# EAGLE schematic board (EAGLE 6.4)
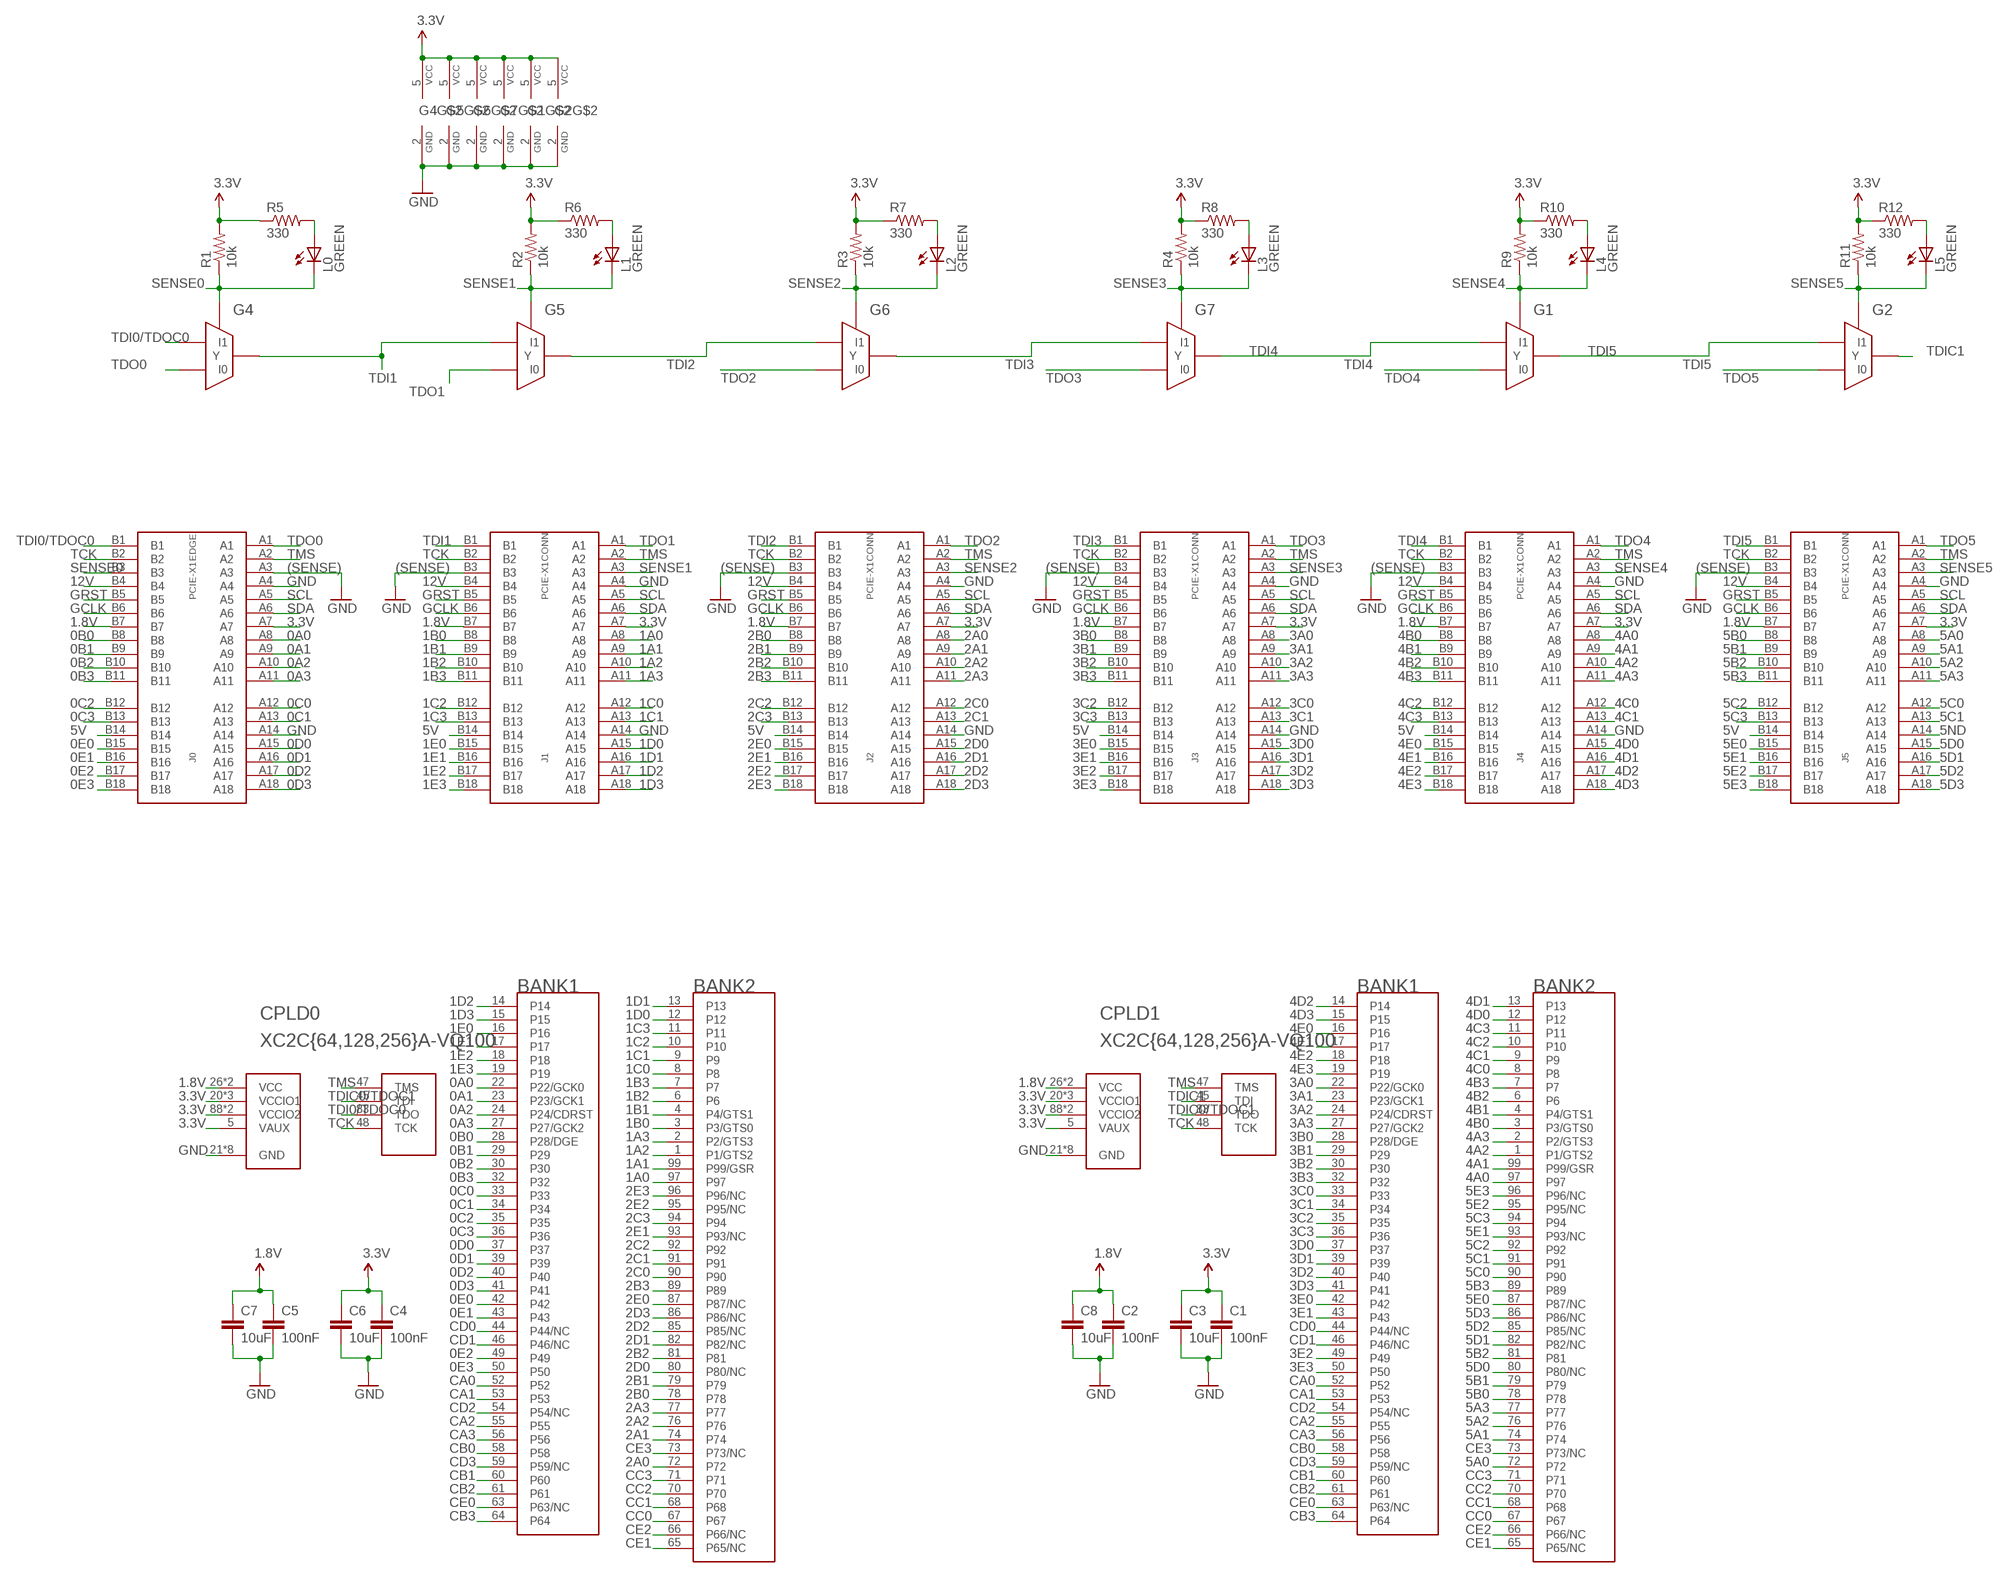
[diagram p0: schematic, sheet 1]

## Parts
C1  100nF  CAP0402-CAP  [0402-CAP]
C2  100nF  CAP0402-CAP  [0402-CAP]
C3  10uF  CAP0805  [0805]
C4  100nF  CAP0402-CAP  [0402-CAP]
C5  100nF  CAP0402-CAP  [0402-CAP]
C6  10uF  CAP0805  [0805]
C7  10uF  CAP0805  [0805]
C8  10uF  CAP0805  [0805]
CPLD0  XC2C{64,128,256}A-VQ100  [XILINX_TQ100]
CPLD1  XC2C{64,128,256}A-VQ100  [XILINX_TQ100]
G1  74G157  [SOT363]
G2  74G157  [SOT363]
G4  74G157  [SOT363]
G5  74G157  [SOT363]
G6  74G157  [SOT363]
G7  74G157  [SOT363]
J0  PCIE-X1EDGE  [PCIE-X1-EDGE]
J1  PCIE-X1CONN  [PCIE-X1-CONN]
J2  PCIE-X1CONN  [PCIE-X1-CONN]
J3  PCIE-X1CONN  [PCIE-X1-CONN]
J4  PCIE-X1CONN  [PCIE-X1-CONN]
J5  PCIE-X1CONN  [PCIE-X1-CONN]
L0  GREEN  LED0603  [0603_LED]
L1  GREEN  LED0603  [0603_LED]
L2  GREEN  LED0603  [0603_LED]
L3  GREEN  LED0603  [0603_LED]
L4  GREEN  LED0603  [0603_LED]
L5  GREEN  LED0603  [0603_LED]
R1  10k  RESISTOR0603  [0603-RES]
R2  10k  RESISTOR0603  [0603-RES]
R3  10k  RESISTOR0603  [0603-RES]
R4  10k  RESISTOR0603  [0603-RES]
R5  330  RESISTOR0603  [0603-RES]
R6  330  RESISTOR0603  [0603-RES]
R7  330  RESISTOR0603  [0603-RES]
R8  330  RESISTOR0603  [0603-RES]
R9  10k  RESISTOR0603  [0603-RES]
R10  330  RESISTOR0603  [0603-RES]
R11  10k  RESISTOR0603  [0603-RES]
R12  330  RESISTOR0603  [0603-RES]

## Nets
0A0: CPLD0.22(P22/GCK0) J0.A8
0A1: CPLD0.23(P23/GCK1) J0.A9
0A2: CPLD0.24(P24/CDRST) J0.A10
0A3: CPLD0.27(P27/GCK2) J0.A11
0B0: CPLD0.28(P28/DGE) J0.B8
0B1: CPLD0.29 J0.B9
0B2: CPLD0.30 J0.B10
0B3: CPLD0.32 J0.B11
0C0: CPLD0.33 J0.A12
0C1: CPLD0.34 J0.A13
0C2: CPLD0.35 J0.B12
0C3: CPLD0.36 J0.B13
0D0: CPLD0.37 J0.A15
0D1: CPLD0.39 J0.A16
0D2: CPLD0.40 J0.A17
0D3: CPLD0.41 J0.A18
0E0: CPLD0.42 J0.B15
0E1: CPLD0.43 J0.B16
0E2: CPLD0.49 J0.B17
0E3: CPLD0.50 J0.B18
1.8V [pwr]: C2.1 C5.1 C7.1 C8.1 CPLD0.26(VCC) CPLD0.57(VCC) CPLD1.26(VCC) CPLD1.57(VCC) J0.B7 J1.B7 J2.B7 J3.B7 J4.B7 J5.B7
1A0: CPLD0.97 J1.A8
1A1: CPLD0.99(P99/GSR) J1.A9
1A2: CPLD0.1(P1/GTS2) J1.A10
1A3: CPLD0.2(P2/GTS3) J1.A11
1B0: CPLD0.3(P3/GTS0) J1.B8
1B1: CPLD0.4(P4/GTS1) J1.B9
1B2: CPLD0.6 J1.B10
1B3: CPLD0.7 J1.B11
1C0: CPLD0.8 J1.A12
1C1: CPLD0.9 J1.A13
1C2: CPLD0.10 J1.B12
1C3: CPLD0.11 J1.B13
1D0: CPLD0.12 J1.A15
1D1: CPLD0.13 J1.A16
1D2: CPLD0.14 J1.A17
1D3: CPLD0.15 J1.A18
1E0: CPLD0.16 J1.B15
1E1: CPLD0.17 J1.B16
1E2: CPLD0.18 J1.B17
1E3: CPLD0.19 J1.B18
2A0: CPLD0.72 J2.A8
2A1: CPLD0.74 J2.A9
2A2: CPLD0.76 J2.A10
2A3: CPLD0.77 J2.A11
2B0: CPLD0.78 J2.B8
2B1: CPLD0.79 J2.B9
2B2: CPLD0.81 J2.B10
2B3: CPLD0.89 J2.B11
2C0: CPLD0.90 J2.A12
2C1: CPLD0.91 J2.A13
2C2: CPLD0.92 J2.B12
2C3: CPLD0.94 J2.B13
2D0: CPLD0.80(P80/NC) J2.A15
2D1: CPLD0.82(P82/NC) J2.A16
2D2: CPLD0.85(P85/NC) J2.A17
2D3: CPLD0.86(P86/NC) J2.A18
2E0: CPLD0.87(P87/NC) J2.B15
2E1: CPLD0.93(P93/NC) J2.B16
2E2: CPLD0.95(P95/NC) J2.B17
2E3: CPLD0.96(P96/NC) J2.B18
3.3V [pwr]: C1.1 C3.1 C4.1 C6.1 CPLD0.5(VAUX) CPLD0.20(VCCIO1) CPLD0.38(VCCIO1) CPLD0.51(VCCIO1) CPLD0.88(VCCIO2) CPLD0.98(VCCIO2) CPLD1.5(VAUX) CPLD1.20(VCCIO1) CPLD1.38(VCCIO1) CPLD1.51(VCCIO1) CPLD1.88(VCCIO2) CPLD1.98(VCCIO2) G1.5(VCC) G2.5(VCC) G4.5(VCC) G5.5(VCC) G6.5(VCC) G7.5(VCC) J0.A7 J1.A7 J2.A7 J3.A7 J4.A7 J5.A7 R1.2 R2.2 R3.2 R4.2 R5.1 R6.1 R7.1 R8.1 R9.2 R10.1 R11.2 R12.1
3A0: CPLD1.22(P22/GCK0) J3.A8
3A1: CPLD1.23(P23/GCK1) J3.A9
3A2: CPLD1.24(P24/CDRST) J3.A10
3A3: CPLD1.27(P27/GCK2) J3.A11
3B0: CPLD1.28(P28/DGE) J3.B8
3B1: CPLD1.29 J3.B9
3B2: CPLD1.30 J3.B10
3B3: CPLD1.32 J3.B11
3C0: CPLD1.33 J3.A12
3C1: CPLD1.34 J3.A13
3C2: CPLD1.35 J3.B12
3C3: CPLD1.36 J3.B13
3D0: CPLD1.37 J3.A15
3D1: CPLD1.39 J3.A16
3D2: CPLD1.40 J3.A17
3D3: CPLD1.41 J3.A18
3E0: CPLD1.42 J3.B15
3E1: CPLD1.43 J3.B16
3E2: CPLD1.49 J3.B17
3E3: CPLD1.50 J3.B18
4A0: CPLD1.97 J4.A8
4A1: CPLD1.99(P99/GSR) J4.A9
4A2: CPLD1.1(P1/GTS2) J4.A10
4A3: CPLD1.2(P2/GTS3) J4.A11
4B0: CPLD1.3(P3/GTS0) J4.B8
4B1: CPLD1.4(P4/GTS1) J4.B9
4B2: CPLD1.6 J4.B10
4B3: CPLD1.7 J4.B11
4C0: CPLD1.8 J4.A12
4C1: CPLD1.9 J4.A13
4C2: CPLD1.10 J4.B12
4C3: CPLD1.11 J4.B13
4D0: CPLD1.12 J4.A15
4D1: CPLD1.13 J4.A16
4D2: CPLD1.14 J4.A17
4D3: CPLD1.15 J4.A18
4E0: CPLD1.16 J4.B15
4E1: CPLD1.17 J4.B16
4E2: CPLD1.18 J4.B17
4E3: CPLD1.19 J4.B18
5A0: CPLD1.72 J5.A8
5A1: CPLD1.74 J5.A9
5A2: CPLD1.76 J5.A10
5A3: CPLD1.77 J5.A11
5B0: CPLD1.78 J5.B8
5B1: CPLD1.79 J5.B9
5B2: CPLD1.81 J5.B10
5B3: CPLD1.89 J5.B11
5C0: CPLD1.90 J5.A12
5C1: CPLD1.91 J5.A13
5C2: CPLD1.92 J5.B12
5C3: CPLD1.94 J5.B13
5D0: CPLD1.80(P80/NC) J5.A15
5D1: CPLD1.82(P82/NC) J5.A16
5D2: CPLD1.85(P85/NC) J5.A17
5D3: CPLD1.86(P86/NC) J5.A18
5E0: CPLD1.87(P87/NC) J5.B15
5E1: CPLD1.93(P93/NC) J5.B16
5E2: CPLD1.95(P95/NC) J5.B17
5E3: CPLD1.96(P96/NC) J5.B18
5ND [pwr]: J5.A14
5V [pwr]: J0.B14 J1.B14 J2.B14 J3.B14 J4.B14 J5.B14
12V [pwr]: J0.B4 J1.B4 J2.B4 J3.B4 J4.B4 J5.B4
CA0: CPLD0.52 CPLD1.52
CA1: CPLD0.53 CPLD1.53
CA2: CPLD0.55 CPLD1.55
CA3: CPLD0.56 CPLD1.56
CB0: CPLD0.58 CPLD1.58
CB1: CPLD0.60 CPLD1.60
CB2: CPLD0.61 CPLD1.61
CB3: CPLD0.64 CPLD1.64
CC0: CPLD0.67 CPLD1.67
CC1: CPLD0.68 CPLD1.68
CC2: CPLD0.70 CPLD1.70
CC3: CPLD0.71 CPLD1.71
CD0: CPLD0.44(P44/NC) CPLD1.44(P44/NC)
CD1: CPLD0.46(P46/NC) CPLD1.46(P46/NC)
CD2: CPLD0.54(P54/NC) CPLD1.54(P54/NC)
CD3: CPLD0.59(P59/NC) CPLD1.59(P59/NC)
CE0: CPLD0.63(P63/NC) CPLD1.63(P63/NC)
CE1: CPLD0.65(P65/NC) CPLD1.65(P65/NC)
CE2: CPLD0.66(P66/NC) CPLD1.66(P66/NC)
CE3: CPLD0.73(P73/NC) CPLD1.73(P73/NC)
GCLK: J0.B6 J1.B6 J2.B6 J3.B6 J4.B6 J5.B6
GND [pwr]: C1.2 C2.2 C3.2 C4.2 C5.2 C6.2 C7.2 C8.2 CPLD0.21(GND) CPLD0.25(GND) CPLD0.31(GND) CPLD0.62(GND) CPLD0.69(GND) CPLD0.75(GND) CPLD0.84(GND) CPLD0.100(GND) CPLD1.21(GND) CPLD1.25(GND) CPLD1.31(GND) CPLD1.62(GND) CPLD1.69(GND) CPLD1.75(GND) CPLD1.84(GND) CPLD1.100(GND) G1.2(GND) G2.2(GND) G4.2(GND) G5.2(GND) G6.2(GND) G7.2(GND) J0.A3 J0.A4 J0.A14 J1.A4 J1.A14 J1.B3 J2.A4 J2.A14 J2.B3 J3.A4 J3.A14 J3.B3 J4.A4 J4.A14 J4.B3 J5.A4 J5.B3
GRST: J0.B5 J1.B5 J2.B5 J3.B5 J4.B5 J5.B5
N$1: L4.A R10.2
N$2: L5.A R12.2
N$3: L0.A R5.2
N$7: L1.A R6.2
N$8: L2.A R7.2
N$9: L3.A R8.2
SCL: J0.A5 J1.A5 J2.A5 J3.A5 J4.A5 J5.A5
SDA: J0.A6 J1.A6 J2.A6 J3.A6 J4.A6 J5.A6
SENSE0: G4.6(S) J0.B3 L0.C R1.1
SENSE1: G5.6(S) J1.A3 L1.C R2.1
SENSE2: G6.6(S) J2.A3 L2.C R3.1
SENSE3: G7.6(S) J3.A3 L3.C R4.1
SENSE4: G1.6(S) J4.A3 L4.C R9.1
SENSE5: G2.6(S) J5.A3 L5.C R11.1
TCK: CPLD0.48(TCK) CPLD1.48(TCK) J0.B2 J1.B2 J2.B2 J3.B2 J4.B2 J5.B2
TDI0/TDOC0: CPLD0.83(TDO) G4.1(I1) J0.B1
TDI1: G4.4(Y) G5.1(I1) J1.B1
TDI2: G5.4(Y) G6.1(I1) J2.B1
TDI3: G6.4(Y) G7.1(I1) J3.B1
TDI4: G1.1(I1) G7.4(Y) J4.B1
TDI5: G1.4(Y) G2.1(I1) J5.B1
TDIC0/TDOC1: CPLD0.45(TDI) CPLD1.83(TDO)
TDIC1: CPLD1.45(TDI) G2.4(Y)
TDO0: G4.3(I0) J0.A1
TDO1: G5.3(I0) J1.A1
TDO2: G6.3(I0) J2.A1
TDO3: G7.3(I0) J3.A1
TDO4: G1.3(I0) J4.A1
TDO5: G2.3(I0) J5.A1
TMS: CPLD0.47(TMS) CPLD1.47(TMS) J0.A2 J1.A2 J2.A2 J3.A2 J4.A2 J5.A2

## Notes on the sheet
- (SENSE) | (SENSE) | (SENSE) | (SENSE) | (SENSE) | (SENSE)

## Library data of the parts
C1-C8 = kmod-passives:CAP: Capacitor Standard 0603 ceramic capacitor, and 0.1" leaded capacitor.
CPLD0 CPLD1 = kmod-xilinx:XC2C{64,128,256}A-VQ100
G1 G2 G4-G7 = kmod-testing:74G157: Single gate mux Similar to the 74*157, but with just a single gate. This is the pinout used by Fairchild/NXP/Toshiba, but the TI parts swap the select (S) and output (Y) pins.
J0 J1-J5 = kmod-connectors:PCIE-X1
L0 L1-L5 = kmod-passives:LED
R1-R12 = kmod-passives:RESISTOR: Resistor Basic schematic elements and footprints for 0603, 1206, and PTH resistors.

## Net classes
1 pwr: width 0.381 mm